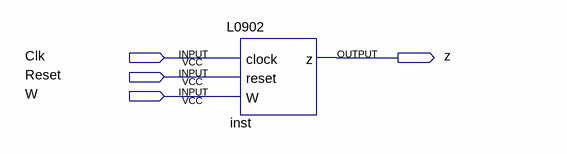
[diagram p0: schematic sheet]
// Quartus schematic L0902.bdf as structural Verilog: 1 symbols, 4 pins
module L0902 (
  input  Clk,
  input  Reset,
  input  W,
  output z
);

  L0902 inst (.clock(Clk), .reset(Reset), .W(W), .z(z));
endmodule
